# EAGLE design x (EAGLE 5.10)
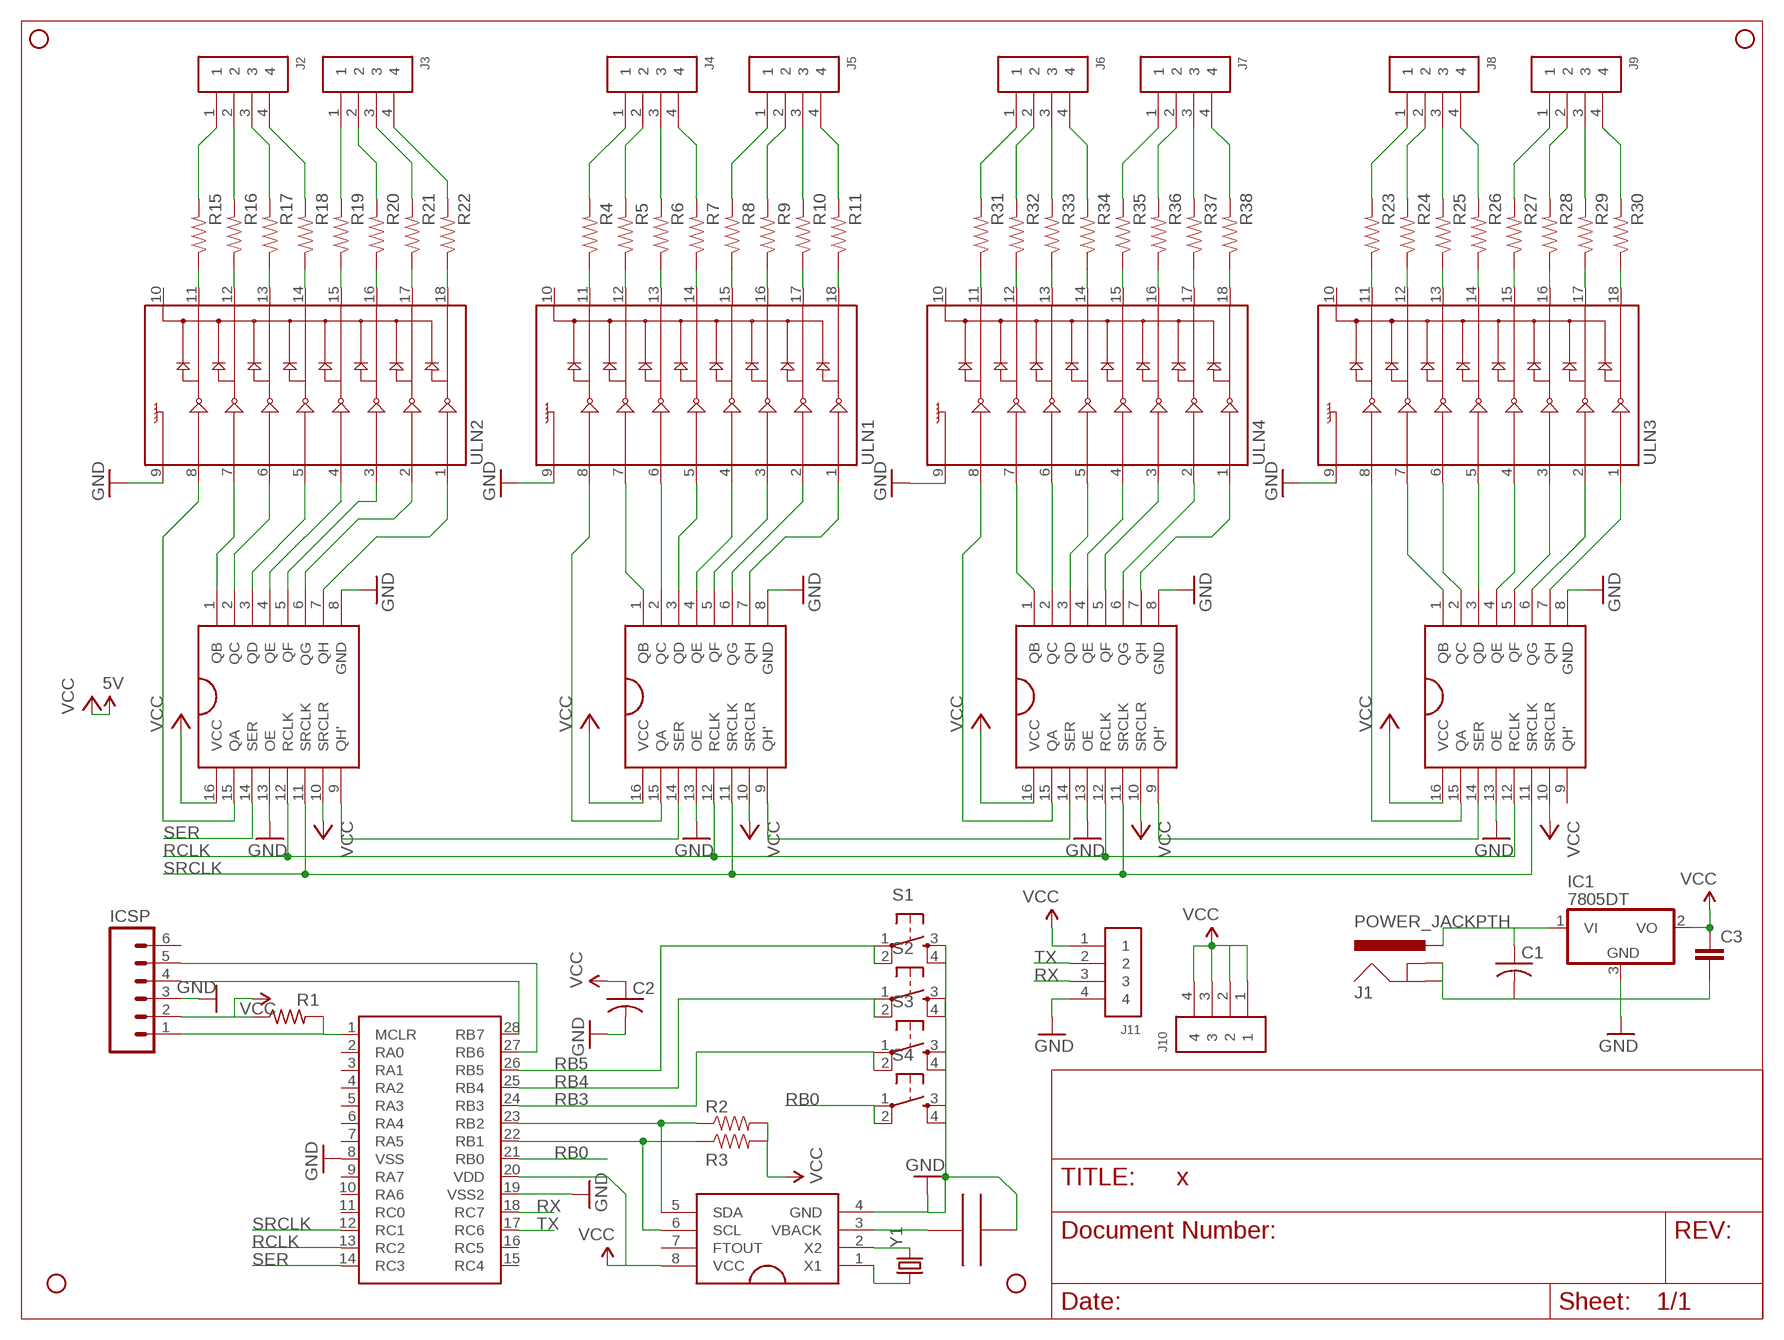
[diagram p0: schematic, sheet 1]

## Parts
C1  C-USC1206  [C1206]
C2  C-USC1206  [C1206]
C3  CAP1206  [1206]
IC1  7805DT  [TO252]
ICSP  M06SIP  [1X06]
J1  POWER_JACKPTH  [POWER_JACK_PTH]
J2  M04_0470531000  [MOLEX_4_LOCKING]
J3  M04_0470531000  [MOLEX_4_LOCKING]
J4  M04_0470531000  [MOLEX_4_LOCKING]
J5  M04_0470531000  [MOLEX_4_LOCKING]
J6  M04_0470531000  [MOLEX_4_LOCKING]
J7  M04_0470531000  [MOLEX_4_LOCKING]
J8  M04_0470531000  [MOLEX_4_LOCKING]
J9  M04_0470531000  [MOLEX_4_LOCKING]
J10  M04_0470531000  [MOLEX_4_LOCKING]
J11  M04_0470531000  [MOLEX_4_LOCKING]
JP4  STAND-OFF  [STAND-OFF]
JP5  STAND-OFF  [STAND-OFF]
JP6  STAND-OFF  [STAND-OFF]
JP7  STAND-OFF  [STAND-OFF]
R1  R-US_M1206  [M1206]
R2  RESISTOR0805-RES  [0805]
R3  RESISTOR0805-RES  [0805]
R4  RESISTOR0805-RES  [0805]
R5  RESISTOR0805-RES  [0805]
R6  RESISTOR0805-RES  [0805]
R7  RESISTOR0805-RES  [0805]
R8  RESISTOR0805-RES  [0805]
R9  RESISTOR0805-RES  [0805]
R10  RESISTOR0805-RES  [0805]
R11  RESISTOR0805-RES  [0805]
R15  RESISTOR0805-RES  [0805]
R16  RESISTOR0805-RES  [0805]
R17  RESISTOR0805-RES  [0805]
R18  RESISTOR0805-RES  [0805]
R19  RESISTOR0805-RES  [0805]
R20  RESISTOR0805-RES  [0805]
R21  RESISTOR0805-RES  [0805]
R22  RESISTOR0805-RES  [0805]
R23  RESISTOR0805-RES  [0805]
R24  RESISTOR0805-RES  [0805]
R25  RESISTOR0805-RES  [0805]
R26  RESISTOR0805-RES  [0805]
R27  RESISTOR0805-RES  [0805]
R28  RESISTOR0805-RES  [0805]
R29  RESISTOR0805-RES  [0805]
R30  RESISTOR0805-RES  [0805]
R31  RESISTOR0805-RES  [0805]
R32  RESISTOR0805-RES  [0805]
R33  RESISTOR0805-RES  [0805]
R34  RESISTOR0805-RES  [0805]
R35  RESISTOR0805-RES  [0805]
R36  RESISTOR0805-RES  [0805]
R37  RESISTOR0805-RES  [0805]
R38  RESISTOR0805-RES  [0805]
S1  TAC_SWITCHPTH  [TACTILE-PTH]
S2  TAC_SWITCHPTH  [TACTILE-PTH]
S3  TAC_SWITCHPTH  [TACTILE-PTH]
S4  TAC_SWITCHPTH  [TACTILE-PTH]
U$2  DS1340  [SOIC8_150]
U$10  SUPERCAP  [SUPERCAP]
U$12  PIC18F26K22_SOIC  [SOIC28]
U$19  SN74HC595DWR  [SOIC16W]
U$20  SN74HC595DWR  [SOIC16W]
U$21  SN74HC595DWR  [SOIC16W]
U$22  SN74HC595DWR  [SOIC16W]
ULN1  ULN2803SOICW  [SO18L]
ULN2  ULN2803SOICW  [SO18L]
ULN3  ULN2803SOICW  [SO18L]
ULN4  ULN2803SOICW  [SO18L]
Y1  CRYSTALTC26H  [TC26H]

## Nets
GND: C1.2 C2.2 C3.2 IC1.3(GND) ICSP.3 J1.GND J1.GNDBREAK J11.4 S1.3 S1.4 S2.3 S2.4 S3.3 S3.4 S4.3 S4.4 U$2.4(GND) U$10.P$2 U$12.8(VSS) U$12.19(VSS2) U$19.8(GND) U$19.13(OE) U$20.8(GND) U$20.13(OE) U$21.8(GND) U$21.13(OE) U$22.8(GND) U$22.13(OE) ULN1.9 ULN2.9 ULN3.9 ULN4.9
N$1: R3.1 U$2.6(SCL) U$12.22(RB1)
N$2: R11.1 ULN1.18
N$3: R10.1 ULN1.17
N$4: R9.1 ULN1.16
N$5: R8.1 ULN1.15
N$6: R7.1 ULN1.14
N$7: R6.1 ULN1.13
N$8: R5.1 ULN1.12
N$9: R4.1 ULN1.11
N$10: R22.1 ULN2.18
N$11: R21.1 ULN2.17
N$12: R20.1 ULN2.16
N$13: R19.1 ULN2.15
N$14: R18.1 ULN2.14
N$15: R17.1 ULN2.13
N$16: R16.1 ULN2.12
N$17: R15.1 ULN2.11
N$18: R2.1 U$2.5(SDA) U$12.23(RB2)
N$19: ICSP.1 R1.2 U$12.1(MCLR)
N$20: R30.1 ULN3.18
N$21: ICSP.4 U$12.28(RB7)
N$22: ICSP.5 U$12.27(RB6)
N$23: R29.1 ULN3.17
N$24: R28.1 ULN3.16
N$25: R27.1 ULN3.15
N$26: R26.1 ULN3.14
N$27: R25.1 ULN3.13
N$28: R24.1 ULN3.12
N$29: R23.1 ULN3.11
N$30: R38.1 ULN4.18
N$31: R37.1 ULN4.17
N$32: R36.1 ULN4.16
N$33: R35.1 ULN4.15
N$34: U$2.2(X2) Y1.2
N$35: U$2.1(X1) Y1.1
N$36: R34.1 ULN4.14
N$37: C1.1 IC1.1(VI) J1.PWR
N$38: R33.1 ULN4.13
N$39: R32.1 ULN4.12
N$40: R31.1 ULN4.11
N$41: U$19.7(QH) ULN2.1
N$42: U$19.15(QA) ULN2.8
N$43: U$19.6(QG) ULN2.2
N$44: U$19.5(QF) ULN2.3
N$45: U$19.4(QE) ULN2.4
N$46: U$19.3(QD) ULN2.5
N$47: U$19.2(QC) ULN2.6
N$48: U$19.1(QB) ULN2.7
N$49: U$20.15(QA) ULN1.8
N$50: U$20.7(QH) ULN1.1
N$51: U$20.3(QD) ULN1.5
N$52: U$20.5(QF) ULN1.3
N$53: U$20.4(QE) ULN1.4
N$54: U$20.6(QG) ULN1.2
N$55: U$20.2(QC) ULN1.6
N$56: U$22.7(QH) ULN3.1
N$57: U$21.15(QA) ULN4.8
N$58: U$20.1(QB) ULN1.7
N$59: U$21.6(QG) ULN4.2
N$60: U$21.5(QF) ULN4.3
N$61: U$21.4(QE) ULN4.4
N$62: U$21.3(QD) ULN4.5
N$63: U$21.2(QC) ULN4.6
N$64: U$21.1(QB) ULN4.7
N$65: U$22.15(QA) ULN3.8
N$66: U$22.1(QB) ULN3.7
N$67: U$21.7(QH) ULN4.1
N$68: U$22.3(QD) ULN3.5
N$69: U$22.4(QE) ULN3.4
N$70: U$22.5(QF) ULN3.3
N$71: U$22.6(QG) ULN3.2
N$72: U$20.9(QH') U$21.14(SER)
N$73: U$22.2(QC) ULN3.6
N$74: U$21.9(QH') U$22.14(SER)
N$75: U$19.9(QH') U$20.14(SER)
N$76: J2.1 R15.2
N$77: U$2.3(VBACK) U$10.P$1
N$78: J2.2 R16.2
N$79: J2.3 R17.2
N$80: J2.4 R18.2
N$81: J3.1 R19.2
N$82: J3.2 R20.2
N$83: J3.3 R21.2
N$84: J3.4 R22.2
N$85: J4.1 R4.2
N$86: J4.4 R7.2
N$87: J4.3 R6.2
N$88: J4.2 R5.2
N$89: J5.1 R8.2
N$90: J5.2 R9.2
N$91: J5.3 R10.2
N$92: J5.4 R11.2
N$93: J6.1 R31.2
N$94: J6.2 R32.2
N$95: J6.3 R33.2
N$96: J6.4 R34.2
N$97: J7.1 R35.2
N$98: J7.2 R36.2
N$99: J7.3 R37.2
N$100: J7.4 R38.2
N$101: J8.1 R23.2
N$102: J8.2 R24.2
N$103: J8.3 R25.2
N$104: J8.4 R26.2
N$105: J9.1 R27.2
N$106: J9.2 R28.2
N$107: J9.3 R29.2
N$108: J9.4 R30.2
RB0: S4.1 S4.2 U$12.21(RB0)
RB3: S3.1 S3.2 U$12.24(RB3)
RB4: S2.1 S2.2 U$12.25(RB4)
RB5: S1.1 S1.2 U$12.26(RB5)
RCLK: U$12.13(RC2) U$19.12(RCLK) U$20.12(RCLK) U$21.12(RCLK) U$22.12(RCLK)
RX: J11.3 U$12.18(RC7)
SER: U$12.14(RC3) U$19.14(SER)
SRCLK: U$12.12(RC1) U$19.11(SRCLK) U$20.11(SRCLK) U$21.11(SRCLK) U$22.11(SRCLK)
TX: J11.2 U$12.17(RC6)
VCC: C2.1 C3.1 IC1.2(VO) ICSP.2 J10.1 J10.2 J10.3 J10.4 J11.1 R1.1 R2.2 R3.2 U$2.8(VCC) U$12.20(VDD) U$19.10(SRCLR) U$19.16(VCC) U$20.10(SRCLR) U$20.16(VCC) U$21.10(SRCLR) U$21.16(VCC) U$22.10(SRCLR) U$22.16(VCC) ; supply symbol labelled 5V
Unconnected: ICSP.6 U$2.7(FTOUT) U$12.2(RA0) U$12.3(RA1) U$12.4(RA2) U$12.5(RA3) U$12.6(RA4) U$12.7(RA5) U$12.9(RA7) U$12.10(RA6) U$12.11(RC0) U$12.15(RC4) U$12.16(RC5) U$22.9(QH') ULN1.10 ULN2.10 ULN3.10 ULN4.10

## Library data of the parts
C1 C2 = resistor:C-US: CAPACITOR, American symbol
C3 = SparkFun:CAP: Capacitor Standard 0603 ceramic capacitor, and 0.1" leaded capacitor.
IC1 = linear:78*: Positive VOLTAGE REGULATOR Source: http://cache.national.com/ds/LM/LM78L05.pdf http://www.fairchildsemi.com/ds/LM/LM7805.pdf
ICSP = SparkFun:M06: Header 6 Standard 6-pin 0.1" header. Use with straight break away headers (SKU : PRT-00116), right angle break away headers (PRT-00553), swiss pins (PRT-00743), machine pins (PRT-00117), and female headers (PRT-00115). Molex polarized connector foot print use with SKU : PRT-08094 with associated crimp pins and housings. NOTES ON THE VARIANTS LOCK and LOCK_LONGPADS... This footprint was designed to help hold the alignment of a through-hole component (i.e. 6-pin header) while soldering it into place. You may notice that each hole has been shifted either up or down by 0.005 of an inch from it's more standard position (which is a perfectly straight line). This slight alteration caused the pins (the squares in the middle) to touch the edges of the holes. Because they are alternating, it causes a "brace" to hold the component in place. 0.005 has proven to be the perfect amount of "off-center" position when using our standard breakaway headers. Although looks a little odd when you look at the bare footprint, once you have a header in there, the alteration is very hard to notice. Also, if you push a header all the way into place, it is covered up entirely on the bottom side. This idea of altering the position of holes to aid alignment will be further integrated into the Sparkfun Library for other footprints. It can help hold any component with 3 or more connection pins.
J1 = SparkFun:POWER_JACK: Power Jack This is the standard 5.5mm barrel jack for power. The PTH is the most common, proven, reliable, footprint. All others are experimental. The Slot footprint only works if the mill layer is transmitted to the PCB fab house so be warned. Spark Fun Electronics SKU : PRT-00119. Mating wall wart : TOL-00298 (and others)
J2-J11 = SP_LIB:M04_0470531000
JP4-JP7 = SparkFun:STAND-OFF: Stand Off This is the mechanical footprint for a #4 phillips button head screw. Use the keepout ring to avoid running the screw head into surrounding components. SKU : PRT-00447
R1 = resistor:R-US_: RESISTOR, American symbol
R2-R11 R15-R38 = SparkFun:RESISTOR: Resistor Basic schematic elements and footprints for 0603, 1206, and PTH resistors.
S1-S4 = SparkFun:TAC_SWITCH: Momentary Switch Button commonly used for reset or general input. Spark Fun Electronics SKU : COM-00097
U$2 = SP_LIB:DS1340
U$10 = SP_LIB:SUPERCAP
U$12 = SP_LIB:PIC18F26K22_SOIC
U$19-U$22 = SP_LIB:SN74HC595DWR
ULN1-ULN4 = SparkFun:ULN2803: Darlington Driver ULN2803 Darlington array. 500mA max per channel, 8-channel package. Spark Fun Electronics SKU : COM-00312
Y1 = SparkFun:CRYSTAL: Crystals Various standard crystals. Proven footprints. Spark Fun Electronics SKU : COM-00534

## Board
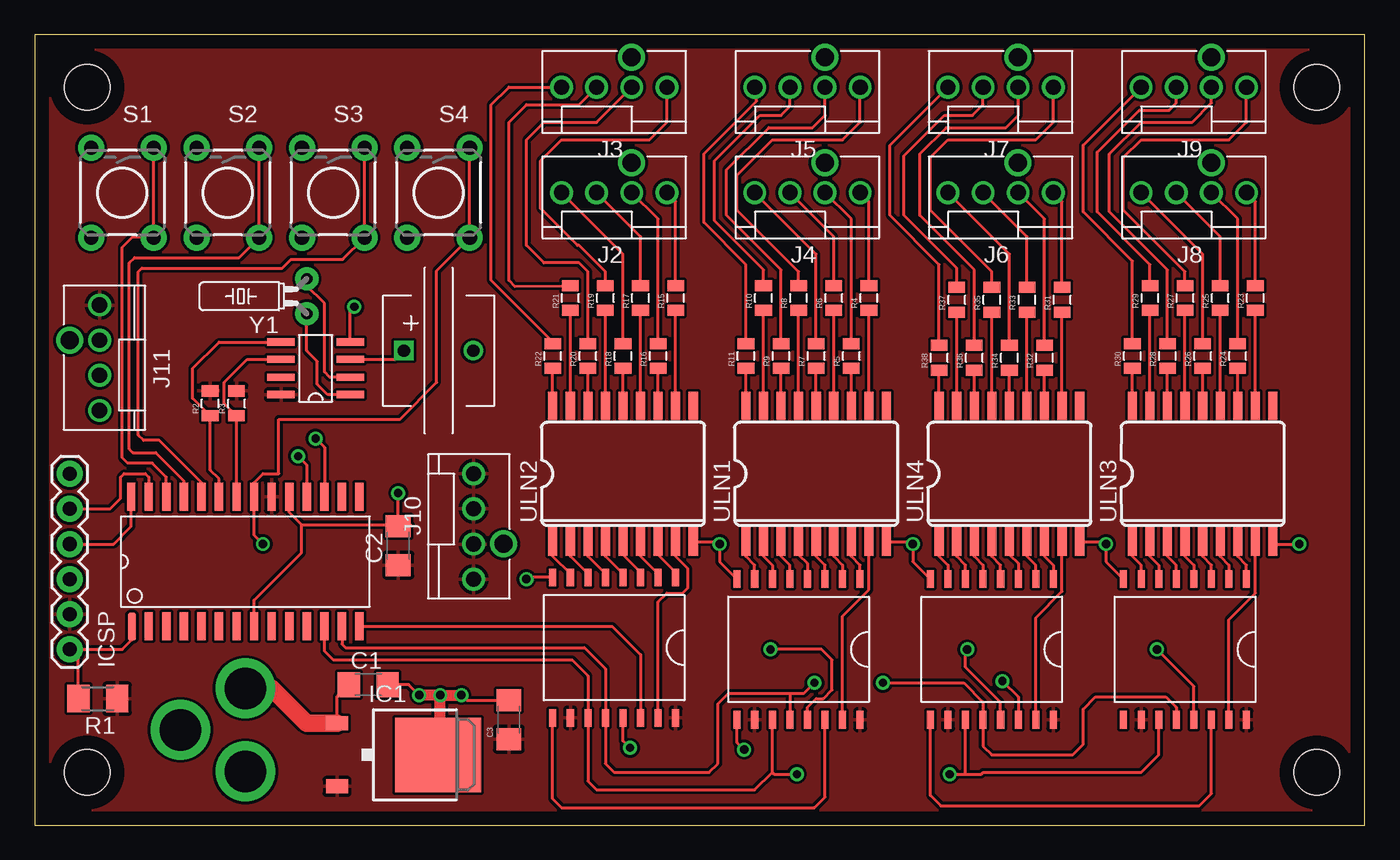
[diagram p1: board, top side]
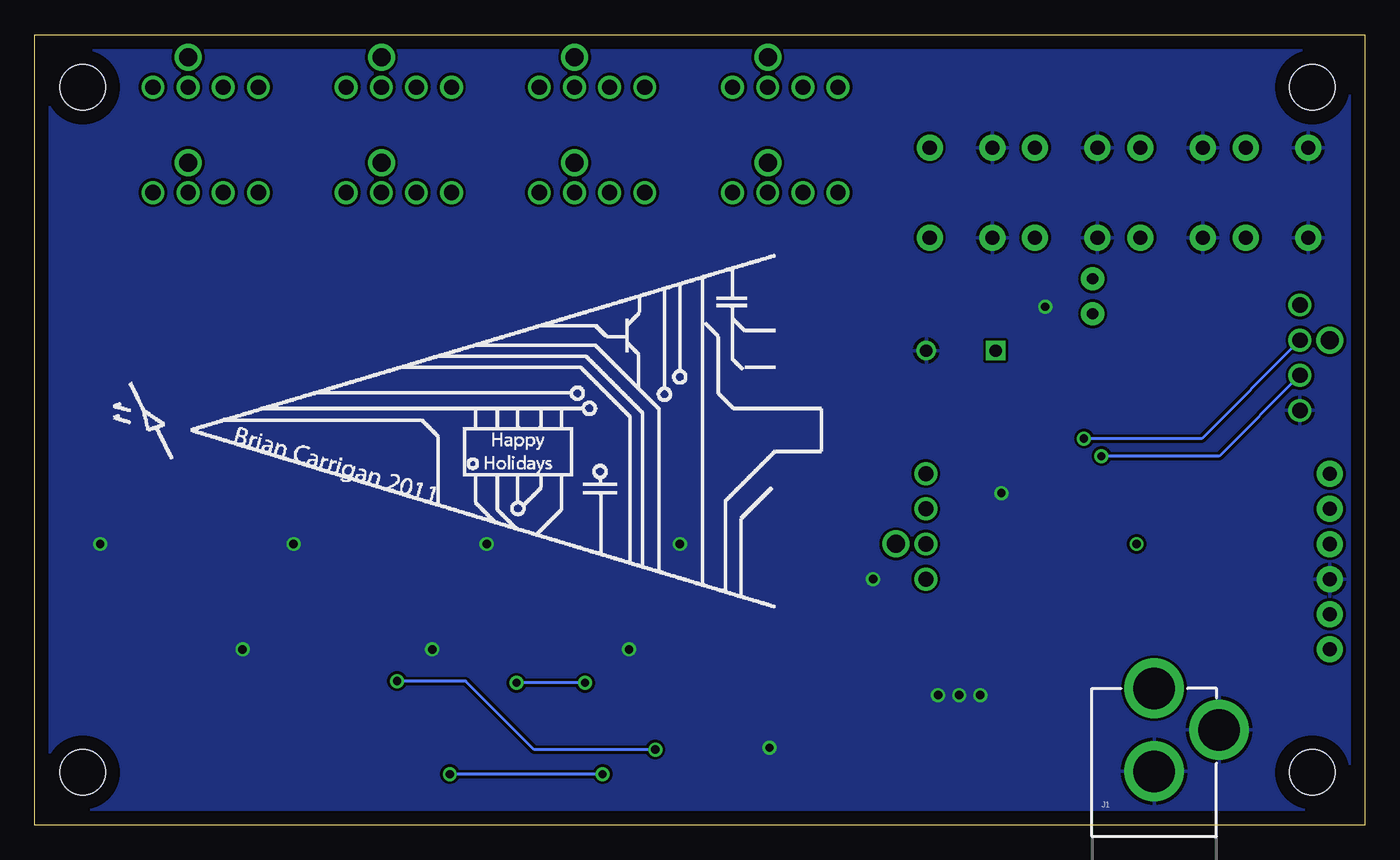
[diagram p2: board, bottom side, seen from below]

Size 96.19 x 57.14 mm. Coordinates in mm from the lower left corner, seen from the top.
Outline: 0,0 96.19,0 96.19,57.14 0,57.14 0,0
Copper layers (1*16): Top 0.035mm / dielectric 1.5mm / Bottom 0.035mm
Design rules "default *": minimum track width 8mil, minimum drill 24mil, track to track 8mil, track to pad 8mil, pad to pad 8mil, via to via 8mil, smd to smd 8mil, copper to edge 40mil, drill to drill 8mil, minimum pad ring 10mil, minimum via ring 8mil, stop-mask expansion 4mil, vias tented up to drill 0mil, thermal gap 10mil

### Footprints (pad centres in the part's own frame; a part is rotated, then mirrored left to right if it is on the bottom)
C1206 = smd 1.6 x 1.8: 1 -1.4,0; 2 1.4,0
1206 = smd 1.6 x 1.8: 1 -1.4,0; 2 1.4,0
TO252 = smd 1 x 1.6: 1 -2.28,-4.8; 2 2.28,-4.8 | smd 5.4 x 6.2: 3 0,2.5
1X06 = drill 1.016 pad 1.88 round: 1 0,0; 2 2.54,0; 3 5.08,0; 4 7.62,0; 5 10.16,0; 6 12.7,0
POWER_JACK_PTH = drill 2.997 pad 4.318 round: GND 0,7.7; GNDBREAK 4.7,10.7; PWR 0,13.7
MOLEX_4_LOCKING = drill 1.1 round: 1 -3.81,0; 2 -1.27,0; 3 1.27,0; 4 3.81,0 | drill 1.3 pad 1.676 round: P$6 -1.26,-2.159
STAND-OFF = hole 3.302: 0,0
M1206 = smd 1.6 x 2: 1 -1.4,0; 2 1.4,0
0805 = smd 0.8 x 1.2: 1 -0.9,0; 2 0.9,0
TACTILE-PTH = drill 1.016 pad 1.88 round: 1 -3.251,2.261; 2 3.251,2.261; 3 -3.251,-2.261; 4 3.251,-2.261
SOIC8_150 = smd 1.98 x 0.53: 1 -2.5,1.9; 2 -2.5,0.65; 3 -2.5,-0.65; 4 -2.5,-1.9; 5 2.5,-1.9; 6 2.5,-0.65; 7 2.5,0.65; 8 2.5,1.9
SUPERCAP = drill 0.9 square: P$1 -2.5,0 | drill 0.9 round: P$2 2.5,0
SOIC28 = smd 0.6 x 2: 1 -8.2,-4.7; 2 -6.985,-4.68; 3 -5.715,-4.68; 4 -4.445,-4.68; 5 -3.175,-4.68; 6 -1.905,-4.68; 7 -0.635,-4.68; 8 0.635,-4.68; 9 1.905,-4.68; 10 3.175,-4.68; 11 4.445,-4.68; 12 5.715,-4.68; 13 6.985,-4.68; 14 8.255,-4.68; 15 8.255,4.68; 16 6.985,4.68; 17 5.715,4.68; 18 4.445,4.68; 19 3.175,4.68; 20 1.905,4.68; 21 0.635,4.68; 22 -0.635,4.68; 23 -1.905,4.68; 24 -3.175,4.68; 25 -4.445,4.68; 26 -5.715,4.68; 27 -6.985,4.68; 28 -8.255,4.68
SOIC16W = smd 1.27 x 0.508: 1 -5.08,5.08; 2 -5.08,3.81; 3 -5.08,2.54; 4 -5.08,1.27; 5 -5.08,0; 6 -5.08,-1.27; 7 -5.08,-2.54; 8 -5.08,-3.81; 9 5.08,-3.81; 10 5.08,-2.54; 11 5.08,-1.27; 12 5.08,0; 13 5.08,1.27; 14 5.08,2.54; 15 5.08,3.81; 16 5.08,5.08
SO18L = smd 0.66 x 2.032: 1 -0.635,-4.902; 2 0.635,-4.902; 3 1.905,-4.902; 4 3.175,-4.902; 5 4.445,-4.902; 6 5.715,-4.902; 7 6.985,-4.902; 8 8.255,-4.902; 9 9.525,-4.902; 10 9.525,4.902; 11 8.255,4.902; 12 6.985,4.902; 13 5.715,4.902; 14 4.445,4.902; 15 3.175,4.902; 16 1.905,4.902; 17 0.635,4.902; 18 -0.635,4.902
TC26H = drill 0.813 pad 1.676 round: 1 -1.27,0; 2 1.27,0

### Placement (x,y rotation side)
C1  24.13,10.16 0 top
C2  26.29,20.19 90 top
C3  34.29,7.62 90 top
IC1  26.67,5.08 270 top
ICSP  2.54,12.7 90 top
J1  15.24,-3.81 0 bottom
J2  41.91,45.72 180 top
J3  41.91,53.34 180 top
J4  55.88,45.72 180 top
J5  55.88,53.34 180 top
J6  69.85,45.72 180 top
J7  69.85,53.34 180 top
J8  83.82,45.72 180 top
J9  83.82,53.34 180 top
J10  31.75,21.59 90 top
J11  4.7,33.78 270 top
JP4  3.81,53.34 0 top
JP5  3.81,3.81 0 top
JP6  92.71,53.34 0 top
JP7  92.71,3.81 0 top
R1  4.57,9.14 180 top
R2  12.7,30.48 90 top
R3  14.61,30.48 90 top
R4  60.33,38.1 90 top
R5  59.05,33.91 90 top
R6  57.78,38.1 90 top
R7  56.52,33.91 90 top
R8  55.24,38.1 90 top
R9  53.98,33.91 90 top
R10  52.7,38.1 90 top
R11  51.44,33.91 90 top
R15  46.35,38.1 90 top
R16  45.09,33.91 90 top
R17  43.81,38.1 90 top
R18  42.55,33.91 90 top
R19  41.27,38.1 90 top
R20  40.01,33.91 90 top
R21  38.73,38.1 90 top
R22  37.47,33.91 90 top
R23  88.27,38.1 90 top
R24  87,33.91 90 top
R25  85.72,38.1 90 top
R26  84.45,33.91 90 top
R27  83.19,38.1 90 top
R28  81.92,33.91 90 top
R29  80.64,38.1 90 top
R30  79.38,33.91 90 top
R31  74.3,37.97 90 top
R32  73.03,33.78 90 top
R33  71.75,37.97 90 top
R34  70.48,33.78 90 top
R35  69.22,37.97 90 top
R36  67.94,33.78 90 top
R37  66.67,37.97 90 top
R38  65.41,33.78 90 top
S1  6.35,45.72 270 top
S2  13.97,45.72 270 top
S3  21.59,45.72 270 top
S4  29.21,45.72 270 top
U$2  20.32,33.02 180 top
U$10  29.21,34.29 0 top
U$12  15.24,19.05 0 top
U$19  41.27,12.83 270 top
U$20  54.61,12.7 270 top
U$21  68.58,12.7 270 top
U$22  82.55,12.7 270 top
ULN1  52.07,25.4 0 top
ULN2  38.1,25.4 0 top
ULN3  80.01,25.4 0 top
ULN4  66.04,25.4 0 top
Y1  19.68,38.23 90 top

### Tracks (layer width: path | path; a pad name or v marks a point on that pad's centre or on a via)
GND  (via drill 0.6)
  Top 0.203: v26.29,24 C2.2 27.18,21.72 19.3,21.72 | U$2.4 22.82,37.17 v23.11,37.47 | 30.73,9.4 30.86,9.53 | C1.2 27.05,10.16 v27.81,9.4 | U$19.8 35.69,17.91 v35.56,17.78 | U$12.19 18.41,22.61 19.3,21.72 | U$22.13 83.82,10.03 v81.15,12.7 | U$21.13 69.85,8.89 67.31,11.43 67.31,12.57 v67.44,12.7 | U$20.13 55.88,8.51 56.52,9.14 57.02,9.14 57.66,9.78 57.66,11.94 56.9,12.7 v53.21,12.7 | U$19.13 42.55,6.1 v43.05,5.59 | C3.2 31.24,9.02 v30.86,9.4 | ULN2.9 49.35,20.5 v49.53,20.32 49.53,19.05 U$20.8 | ULN1.9 63.32,20.5 v63.5,20.32 63.5,19.05 U$21.8 | U$22.8 77.47,19.05 v77.47,20.32 77.29,20.5 ULN4.9 | v91.44,20.32 89.71,20.32 ULN3.9 | 19.3,21.72 19.3,19.68 15.88,16.26 U$12.8
  Top 0.813: v29.34,9.4 v27.81,9.4 | v29.34,9.4 30.73,9.4 | v29.34,9.4 29.34,5.25 IC1.3
  pour Bottom: 0,57.15 105.41,57.15 104.14,0 0,0
N$1
  Top 0.203: U$2.6 15.38,33.67 13.72,32 13.72,30.47 R3.1 U$12.22
N$2
  Top 0.203: ULN1.18 R11.1
N$3
  Top 0.203: ULN1.17 R10.1
N$4
  Top 0.203: ULN1.16 R9.1
N$5
  Top 0.203: ULN1.15 R8.1
N$6
  Top 0.203: ULN1.14 R7.1
N$7
  Top 0.203: ULN1.13 R6.1
N$8
  Top 0.203: ULN1.12 R5.1
N$9
  Top 0.203: ULN1.11 R4.1
N$10
  Top 0.203: ULN2.18 R22.1
N$11
  Top 0.203: ULN2.17 R21.1
N$12
  Top 0.203: ULN2.16 R20.1
N$13
  Top 0.203: ULN2.15 R19.1
N$14
  Top 0.203: ULN2.14 R18.1
N$15
  Top 0.203: ULN2.13 R17.1
N$16
  Top 0.203: ULN2.12 R16.1
N$17
  Top 0.203: ULN2.11 R15.1
N$18
  Top 0.203: U$2.5 13.33,34.92 11.43,33.02 11.43,30.85 R2.1 12.7,25.65 13.34,25.02 U$12.23
N$19
  Top 0.203: R1.2 3.17,12.07 ICSP.1 6.35,12.7 7.04,13.39 U$12.1
N$20
  Top 0.203: ULN3.18 R30.1
N$21
  Top 0.203: ICSP.4 5.71,20.32 6.99,21.59 U$12.28
N$22
  Top 0.203: ICSP.5 5.46,22.86 6.22,23.62 6.22,25.15 6.48,25.4 8,25.4 8.26,25.15 U$12.27
N$23
  Top 0.203: ULN3.17 R29.1
N$24
  Top 0.203: ULN3.16 R28.1
N$25
  Top 0.203: ULN3.15 R27.1
N$26
  Top 0.203: ULN3.14 R26.1
N$27
  Top 0.203: ULN3.13 R25.1
N$28
  Top 0.203: ULN3.12 R24.1
N$29
  Top 0.203: ULN3.11 R23.1
N$30
  Top 0.203: ULN4.18 R38.1
N$31
  Top 0.203: ULN4.17 R37.1
N$32
  Top 0.203: ULN4.16 R36.1
N$33
  Top 0.203: ULN4.15 R35.1
N$34
  Top 0.203: Y1.2 19.68,38.99 20.95,37.72 20.95,32.77 21.35,32.37 U$2.2
N$35
  Top 0.203: U$2.1 21.2,31.12 20.45,31.88 20.45,33.53 19.68,34.29 Y1.1
N$36
  Top 0.203: ULN4.14 R34.1
N$37
  Top 0.203: IC1.1 21.87,9.3 C1.1
  Top 1.27: J1.PWR 15.35,9.89 15.37,9.91 15.24,10.03 15.24,9.91 17.14,9.91 19.68,7.37 IC1.1
N$38
  Top 0.203: ULN4.13 R33.1
N$39
  Top 0.203: ULN4.12 R32.1
N$40
  Top 0.203: ULN4.11 R31.1
N$41
  Top 0.203: U$19.7 38.73,18.16 37.47,19.43 ULN2.1
N$42
  Top 0.203: U$19.15 45.09,16.13 45.72,16.76 46.86,16.76 47.24,17.14 47.24,18.54 46.35,19.43 ULN2.8
N$43
  Top 0.203: U$19.6 40.01,18.16 38.73,19.43 ULN2.2
N$44
  Top 0.203: U$19.5 41.27,18.16 40.01,19.43 ULN2.3
N$45
  Top 0.203: U$19.4 42.55,18.16 41.27,19.43 ULN2.4
N$46
  Top 0.203: U$19.3 43.81,18.29 42.55,19.56 ULN2.5
N$47
  Top 0.203: U$19.2 45.09,18.16 43.81,19.43 ULN2.6
N$48
  Top 0.203: U$19.1 46.35,18.29 45.09,19.56 ULN2.7
N$49
  Top 0.203: U$20.15 58.42,15.11 60.33,17.02 ULN1.8
N$50
  Top 0.203: U$20.7 52.07,18.8 51.44,19.43 ULN1.1
N$51
  Top 0.203: U$20.3 57.15,18.8 56.52,19.43 ULN1.5
N$52
  Top 0.203: U$20.5 54.61,18.8 53.98,19.43 ULN1.3
N$53
  Top 0.203: U$20.4 55.88,18.92 55.24,19.56 ULN1.4
N$54
  Top 0.203: U$20.6 53.34,18.8 52.7,19.43 ULN1.2
N$55
  Top 0.203: U$20.2 58.42,18.8 57.78,19.43 ULN1.6
N$56
  Top 0.203: U$22.7 80.01,18.8 79.38,19.43 ULN3.1
N$57
  Top 0.203: U$21.15 72.39,14.99 74.3,16.89 ULN4.8
N$58
  Top 0.203: U$20.1 59.69,18.8 59.05,19.43 ULN1.7
N$59
  Top 0.203: U$21.6 67.31,18.8 66.67,19.43 ULN4.2
N$60
  Top 0.203: U$21.5 68.58,18.8 67.94,19.43 ULN4.3
N$61
  Top 0.203: U$21.4 69.85,18.8 69.22,19.43 ULN4.4
N$62
  Top 0.203: U$21.3 71.12,18.92 70.48,19.56 ULN4.5
N$63
  Top 0.203: U$21.2 72.39,18.8 71.75,19.43 ULN4.6
N$64
  Top 0.203: U$21.1 73.66,18.8 73.03,19.43 73.03,19.81 72.9,19.94 72.9,20.37 ULN4.7
N$65
  Top 0.203: U$22.15 86.36,14.86 88.27,16.76 ULN3.8
N$66
  Top 0.203: U$22.1 87.63,18.8 87,19.43 ULN3.7
N$67
  Top 0.203: U$21.7 66.04,18.8 65.41,19.43 ULN4.1
N$68
  Top 0.203: U$22.3 85.09,18.8 84.45,19.43 ULN3.5
N$69
  Top 0.203: U$22.4 83.82,18.8 83.19,19.43 ULN3.4
N$70
  Top 0.203: U$22.5 82.55,18.8 81.92,19.43 ULN3.3
N$71
  Top 0.203: U$22.6 81.28,18.8 80.64,19.43 ULN3.2
N$72  (via drill 0.6)
  Top 0.203: U$20.9 50.8,5.97 v51.31,5.46 | U$21.14 71.12,9.27 v69.98,10.41
  Bottom 0.203: v69.98,10.41 65.02,10.41 60.07,5.46 v51.31,5.46
N$73
  Top 0.203: U$22.2 86.36,18.8 85.72,19.43 ULN3.6
N$74
  Top 0.203: U$21.9 64.77,2.16 65.53,1.4 84.2,1.4 85.09,2.29 U$22.14
N$75
  Top 0.203: U$19.9 37.47,1.91 38.1,1.27 56.39,1.27 57.15,2.03 U$20.14
N$76
  Top 0.203: R15.2 46.35,45.09 J2.1
N$77
  Top 0.203: U$2.3 26.09,33.67 U$10.P$1
N$78
  Top 0.203: R16.2 45.09,43.81 J2.2
N$79
  Top 0.203: R17.2 43.81,42.55 J2.3
N$80
  Top 0.203: R18.2 42.55,41.27 J2.4
N$81
  Top 0.203: R19.2 41.27,40.01 39.37,41.91 39.24,41.91 36.58,44.58 36.58,48.01 38.1,49.53 44.45,49.53 45.72,50.8 J3.1
N$82
  Top 0.203: R20.2 40.01,40.01 39.37,40.64 36.83,40.64 35.56,41.91 35.56,49.53 36.83,50.8 40.64,50.8 J3.2
N$83
  Top 0.203: R21.2 34.71,38.95 34.29,39.37 34.29,50.8 35.56,52.07 39.37,52.07 J3.3
N$84
  Top 0.203: R22.2 37.47,34.92 33.02,39.37 33.02,52.07 34.29,53.34 J3.4
N$85
  Top 0.203: R4.2 60.33,45.09 J4.1
N$86
  Top 0.203: R7.2 56.52,41.27 J4.4
N$87
  Top 0.203: R6.2 57.78,42.55 J4.3
N$88
  Top 0.203: R5.2 59.05,43.81 J4.2
N$89
  Top 0.203: R8.2 55.24,40.01 50.8,44.45 50.8,46.99 53.34,49.53 58.42,49.53 59.69,50.8 J5.1
N$90
  Top 0.203: R9.2 53.98,40.13 50.04,44.07 50.04,47.37 53.09,50.42 56.26,50.42 57.15,51.31 J5.2
N$91
  Top 0.203: R10.2 52.7,40.13 49.15,43.69 49.15,48.01 52.45,51.31 53.98,51.31 54.61,51.94 J5.3
N$92
  Top 0.203: R11.2 51.44,40.51 48.39,43.56 48.39,48.51 52.2,52.32 52.2,53.21 J5.4
N$93
  Top 0.203: R31.2 74.3,45.09 J6.1
N$94
  Top 0.203: R32.2 73.03,43.81 J6.2
N$95
  Top 0.203: R33.2 71.75,42.55 J6.3
N$96
  Top 0.203: R34.2 70.48,41.27 J6.4
N$97
  Top 0.203: R35.2 69.22,40.01 64.77,44.45 64.77,48.26 66.04,49.53 72.39,49.53 73.66,50.8 J7.1
N$98
  Top 0.203: R36.2 67.94,40.13 64.01,44.07 64.01,48.51 65.91,50.42 70.23,50.42 71.12,51.31 J7.2
N$99
  Top 0.203: R37.2 66.67,40.26 62.87,44.07 62.87,48.39 65.79,51.31 67.82,51.31 68.58,52.07 J7.3
N$100
  Top 0.203: R38.2 65.41,40.51 61.85,44.07 61.85,49.15 J7.4
N$101
  Top 0.203: R23.2 88.27,45.09 J8.1
N$102
  Top 0.203: R24.2 87,43.81 J8.2
N$103
  Top 0.203: R25.2 85.72,42.55 J8.3
N$104
  Top 0.203: R26.2 84.45,41.27 J8.4
N$105
  Top 0.203: R27.2 83.19,40.01 78.74,44.45 78.74,48.26 80.01,49.53 86.36,49.53 87.63,50.8 J9.1
N$106
  Top 0.203: R28.2 81.92,40.13 77.72,44.32 77.72,48.51 80.01,50.8 83.69,50.8 85.09,52.2 J9.2
N$107
  Top 0.203: R29.2 80.64,40.51 76.83,44.32 76.83,48.64 79.88,51.69 82.04,51.69 82.55,52.2 J9.3
N$108
  Top 0.203: R30.2 79.38,40.77 75.82,44.32 75.82,49.15 J9.4
RB0  (via drill 0.6)
  Top 0.203: S4.1 S4.2 29.08,40.08 29.08,32 26.42,29.34 17.65,29.34 17.65,25.4 16.51,25.4 15.88,24.77 U$12.21 15.88,20.95 v16.51,20.32
  Bottom 0.203: v16.51,20.32 16.64,20.45
RB3
  Top 0.203: U$12.24 12.06,24.77 9.02,27.81 7.87,27.81 7.49,28.19 7.49,40.01 7.75,40.26 17.91,40.26 18.54,40.89 22.28,40.89 S3.2 S3.1
RB4
  Top 0.203: U$12.25 10.79,24.89 8.76,26.92 7.11,26.92 6.86,27.18 6.86,40.64 7.24,41.02 14.78,41.02 S2.2 S2.1
RB5
  Top 0.203: U$12.26 9.53,25.15 8.51,26.16 6.73,26.16 6.35,26.54 6.35,41.78 7.11,42.55 8.53,42.55 S1.2 S1.1
RCLK  (via drill 0.6)
  Top 0.203: U$12.13 22.23,13.08 22.48,12.83 39.75,12.83 41.27,11.3 U$19.12 41.27,4.45 41.91,3.81 48.77,3.81 49.4,4.45 49.4,8.76 50.16,9.53 54.61,9.53 | U$22.12 82.55,8.51 81.79,9.27 76.71,9.27 75.82,8.38 75.82,5.84 75.06,5.08 69.22,5.08 68.58,5.71 U$21.12 68.58,8.89 67.18,10.29 v61.34,10.29 | 56.01,10.29 v56.39,10.29 55.63,9.53 54.61,9.53 | 54.61,9.53 U$20.12
  Bottom 0.203: v56.39,10.29 v61.34,10.29
RX  (via drill 0.6)
  Top 0.203: U$12.18 19.68,26.04 v19.05,26.67
  Bottom 0.203: v19.05,26.67 10.54,26.67 J11.3
SER
  Top 0.203: U$12.14 41.76,14.37 43.81,12.32 U$19.14
SRCLK  (via drill 0.6)
  Top 0.203: U$12.12 20.95,12.57 21.59,11.94 38.86,11.94 40.01,10.79 U$19.11 40.01,3.17 40.64,2.54 52.07,2.54 53.34,3.81 | 53.34,3.81 U$20.11 | U$22.11 81.28,5.08 80.01,3.81 68.58,3.81 68.45,3.68 67.31,3.68 | v55.12,3.68 53.47,3.68 53.34,3.81 | v66.17,3.68 67.31,3.68 | 67.31,3.68 U$21.11
  Bottom 0.203: v55.12,3.68 v66.17,3.68
TX  (via drill 0.6)
  Top 0.203: U$12.17 20.95,27.3 v20.32,27.94
  Bottom 0.203: v20.32,27.94 11.81,27.94 J11.2
VCC
  pour Top: 0,0 0,57.15 101.6,57.15 101.6,0